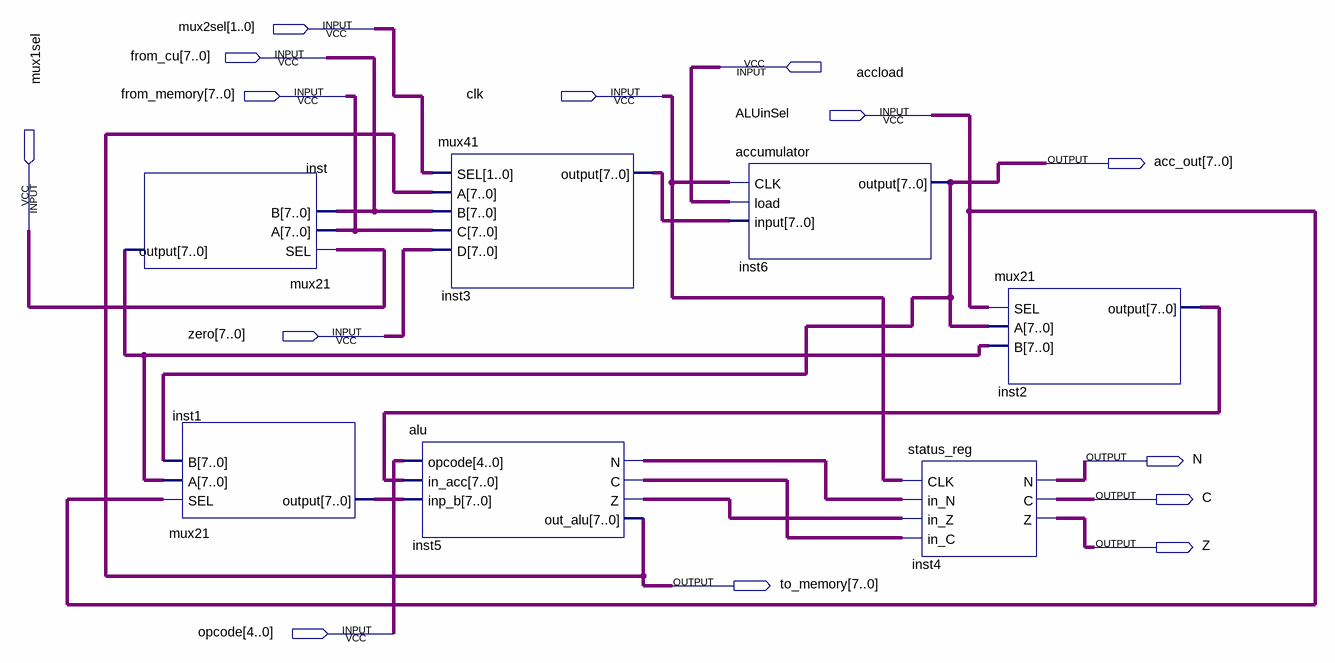
[diagram p0: schematic sheet]
// Quartus schematic datapath.bdf as structural Verilog: 7 symbols, 14 pins
module datapath (
  input  [1:0] mux2sel,
  input  [7:0] from_cu,
  input  accload,
  input  [7:0] from_memory,
  input  clk,
  input  ALUinSel,
  input  mux1sel,
  input  [7:0] zero,
  input  [4:0] opcode,
  output [7:0] acc_out,
  output N,
  output C,
  output Z,
  output [7:0] to_memory
);

  wire inst5_c, inst5_n, inst5_z;
  wire [7:0] inst1_output, inst2_output, inst3_output, inst_output;

  mux21 inst (.SEL(mux1sel), .A(from_memory), .B(from_cu), .\output (inst_output));
  mux21 inst1 (.SEL(ALUinSel), .A(inst_output), .B(acc_out), .\output (inst1_output));
  mux41 inst3 (.SEL(mux2sel), .A(to_memory), .B(from_cu), .C(from_memory), .D(zero), .\output (inst3_output));
  alu inst5 (
    .opcode(opcode), .in_acc(inst2_output), .inp_b(inst1_output), .N(inst5_n), .C(inst5_c), .Z(inst5_z),
    .out_alu(to_memory));
  accumulator inst6 (.CLK(clk), .load(accload), .\input (inst3_output), .\output (acc_out));
  status_reg inst4 (.CLK(clk), .in_N(inst5_n), .in_Z(inst5_z), .in_C(inst5_c), .N(N), .C(C), .Z(Z));
  mux21 inst2 (.SEL(ALUinSel), .A(acc_out), .B(inst_output), .\output (inst2_output));
endmodule
